# Altium schematic sheet Raspberry_Pi4.SchDoc
size 381 x 241 mm; SheetNumber: 3; SheetTotal: 11
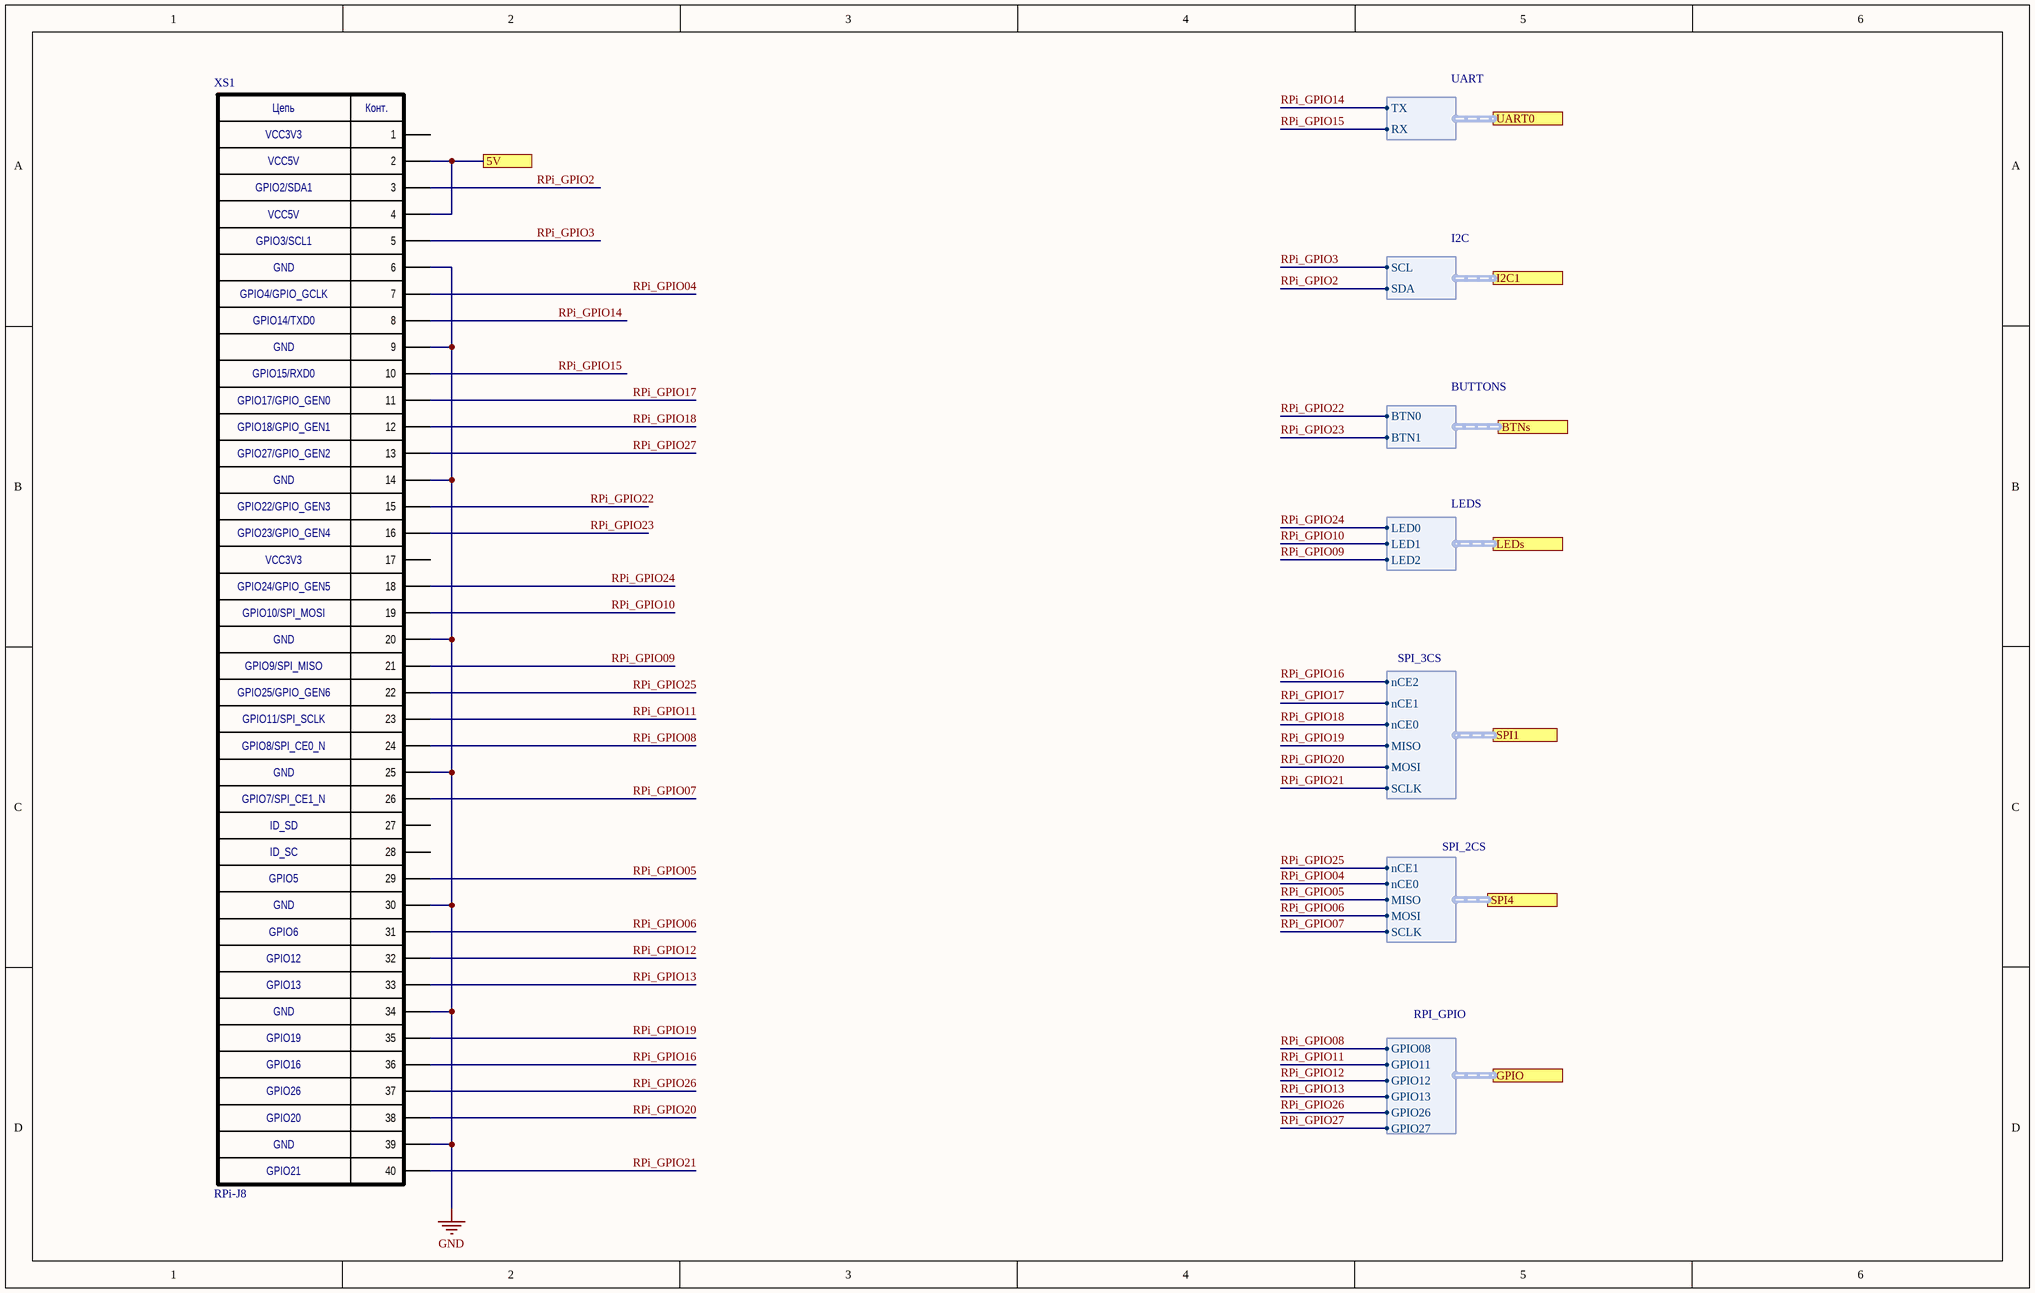
[diagram p0: Raspberry_Pi4.SchDoc]

## Parts
XS1  RPi-J8  40: GPIO21  39: GND  38: GPIO20  37: GPIO26  36: GPIO16  35: GPIO19  33: GPIO13  32: GPIO12  31: GPIO6  29: GPIO5  28: ID_SC  27: ID_SD  26: GPIO7/SPI_CE1_N  24: GPIO8/SPI_CE0_N  23: GPIO11/SPI_SCLK  22: GPIO25/GPIO_GEN6  21: GPIO9/SPI_MISO  19: GPIO10/SPI_MOSI  18: GPIO24/GPIO_GEN5  17: VCC3V3  16: GPIO23/GPIO_GEN4  15: GPIO22/GPIO_GEN3  13: GPIO27/GPIO_GEN2  8: GPIO14/TXD0  7: GPIO4/GPIO_GCLK  12: GPIO18/GPIO_GEN1  5: GPIO3/SCL1  4: VCC5V  3: GPIO2/SDA1  11: GPIO17/GPIO_GEN0  10: GPIO15/RXD0  [RaPi_PLD-40]

## Ports
5V, BTNs (harness BUTTONS), GPIO (harness RPI_GPIO), I2C1 (harness I2C), LEDs (harness LEDS), SPI1 (harness SPI_3CS), SPI4 (harness SPI_2CS), UART0 (harness UART)

## Harnesses
UART: TX, RX
I2C: SCL, SDA
RPI_GPIO: GPIO08, GPIO11, GPIO26, GPIO27, GPIO12, GPIO13
BUTTONS: BTN0, BTN1
LEDS: LED0, LED1, LED2
SPI_2CS: nCE1, nCE0, MISO, MOSI, SCLK
SPI_3CS: MISO, MOSI, nCE0, nCE1, nCE2, SCLK

## Nets
GND: XS1.6 XS1.9 XS1.14 XS1.20 XS1.25 XS1.30 XS1.34 XS1.39
5V: XS1.2 XS1.4 ; port 5V
RPi_GPIO2: XS1.3 ; port I2C1.SDA
RPi_GPIO3: XS1.5 ; port I2C1.SCL
RPi_GPIO04: XS1.7 ; port SPI4.nCE0
RPi_GPIO05: XS1.29 ; port SPI4.MISO
RPi_GPIO06: XS1.31 ; port SPI4.MOSI
RPi_GPIO07: XS1.26 ; port SPI4.SCLK
RPi_GPIO08: XS1.24 ; port GPIO.GPIO08
RPi_GPIO09: XS1.21 ; port LEDs.LED2
RPi_GPIO10: XS1.19 ; port LEDs.LED1
RPi_GPIO11: XS1.23 ; port GPIO.GPIO11
RPi_GPIO12: XS1.32 ; port GPIO.GPIO12
RPi_GPIO13: XS1.33 ; port GPIO.GPIO13
RPi_GPIO14: XS1.8 ; port UART0.TX
RPi_GPIO15: XS1.10 ; port UART0.RX
RPi_GPIO16: XS1.36 ; port SPI1.nCE2
RPi_GPIO17: XS1.11 ; port SPI1.nCE1
RPi_GPIO18: XS1.12 ; port SPI1.nCE0
RPi_GPIO19: XS1.35 ; port SPI1.MISO
RPi_GPIO20: XS1.38 ; port SPI1.MOSI
RPi_GPIO21: XS1.40 ; port SPI1.SCLK
RPi_GPIO22: XS1.15 ; port BTNs.BTN0
RPi_GPIO23: XS1.16 ; port BTNs.BTN1
RPi_GPIO24: XS1.18 ; port LEDs.LED0
RPi_GPIO25: XS1.22 ; port SPI4.nCE1
RPi_GPIO26: XS1.37 ; port GPIO.GPIO26
RPi_GPIO27: XS1.13 ; port GPIO.GPIO27

Not connected (* = marked no-connect by the designer): XS1 1 17 27 28

## Notes on the sheet
- (in symbol RPi-J8) Цепь; Конт.

## Library data of the parts
XS1 = RPi-J8: 34: GND; 30: GND; 25: GND; 20: GND; 14: GND; 9: GND; 2: VCC5V; 6: GND; 1: VCC3V3